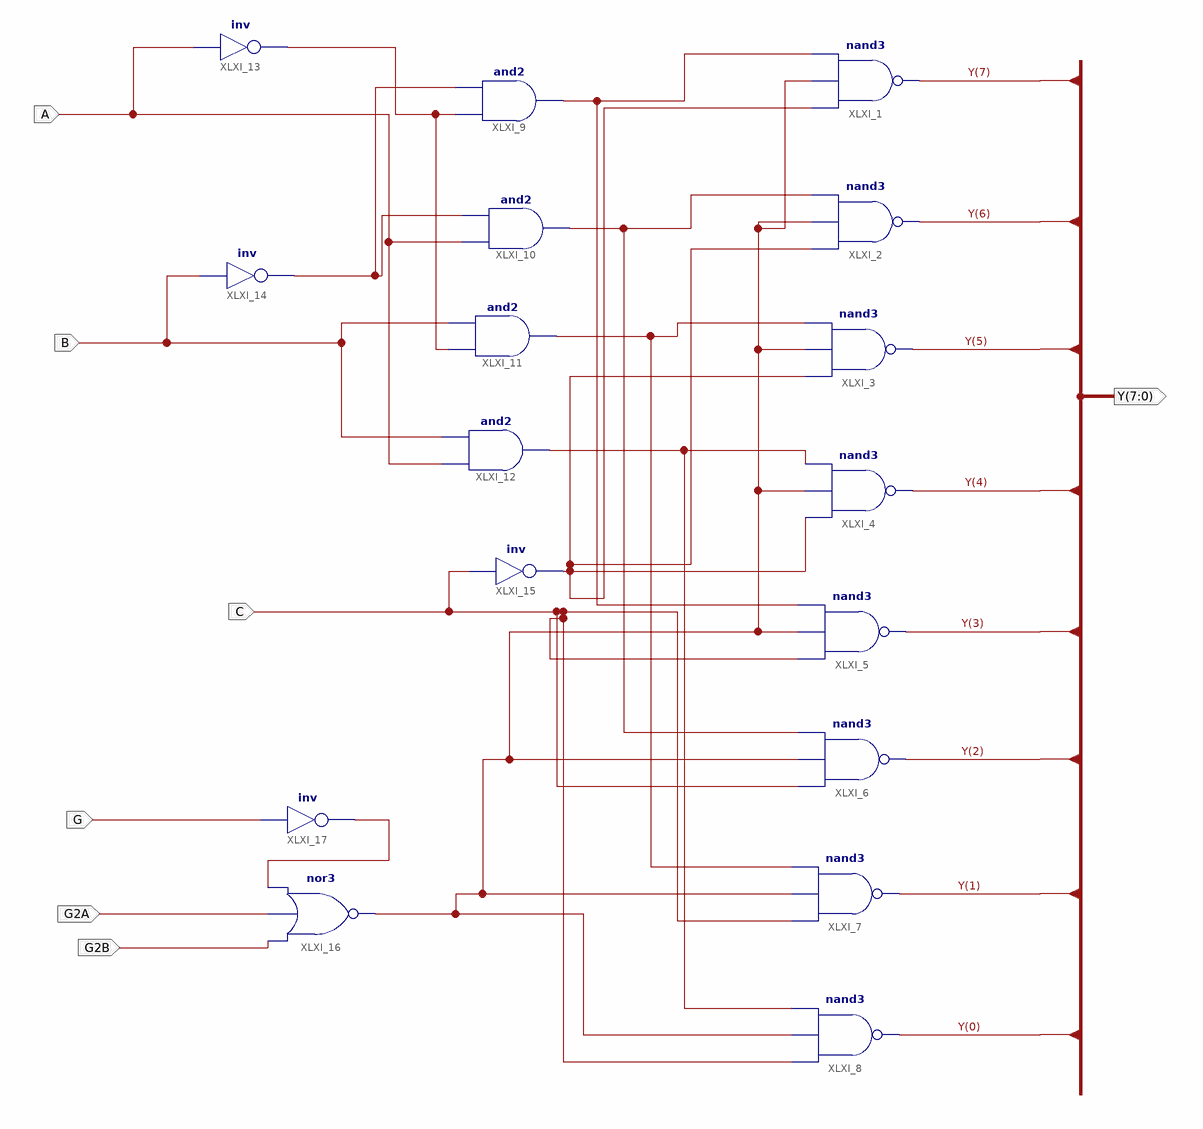
[diagram p0: schematic sheet 1]
// Xilinx ISE schematic D_74LS138.sch (kintex7) as structural Verilog: 17 symbols, 7 ports
module D_74LS138 (
  input  A,
  input  B,
  input  C,
  input  G,
  input  G2A,
  input  G2B,
  output [7:0] Y
);

  wire XLXN_9, XLXN_14, XLXN_18, XLXN_20, XLXN_22, XLXN_24, XLXN_28, XLXN_33, XLXN_43;

  nand XLXI_1 (Y[7], XLXN_28, XLXN_43, XLXN_18);
  nand XLXI_2 (Y[6], XLXN_28, XLXN_43, XLXN_20);
  nand XLXI_3 (Y[5], XLXN_28, XLXN_43, XLXN_22);
  nand XLXI_4 (Y[4], XLXN_28, XLXN_43, XLXN_24);
  nand XLXI_5 (Y[3], C, XLXN_43, XLXN_18);
  nand XLXI_6 (Y[2], C, XLXN_43, XLXN_20);
  nand XLXI_7 (Y[1], C, XLXN_43, XLXN_22);
  nand XLXI_8 (Y[0], C, XLXN_43, XLXN_24);
  and XLXI_9 (XLXN_18, XLXN_9, XLXN_14);
  and XLXI_10 (XLXN_20, A, XLXN_14);
  and XLXI_11 (XLXN_22, XLXN_9, B);
  and XLXI_12 (XLXN_24, A, B);
  not XLXI_13 (XLXN_9, A);
  not XLXI_14 (XLXN_14, B);
  not XLXI_15 (XLXN_28, C);
  nor XLXI_16 (XLXN_43, G2B, G2A, XLXN_33);
  not XLXI_17 (XLXN_33, G);
endmodule
